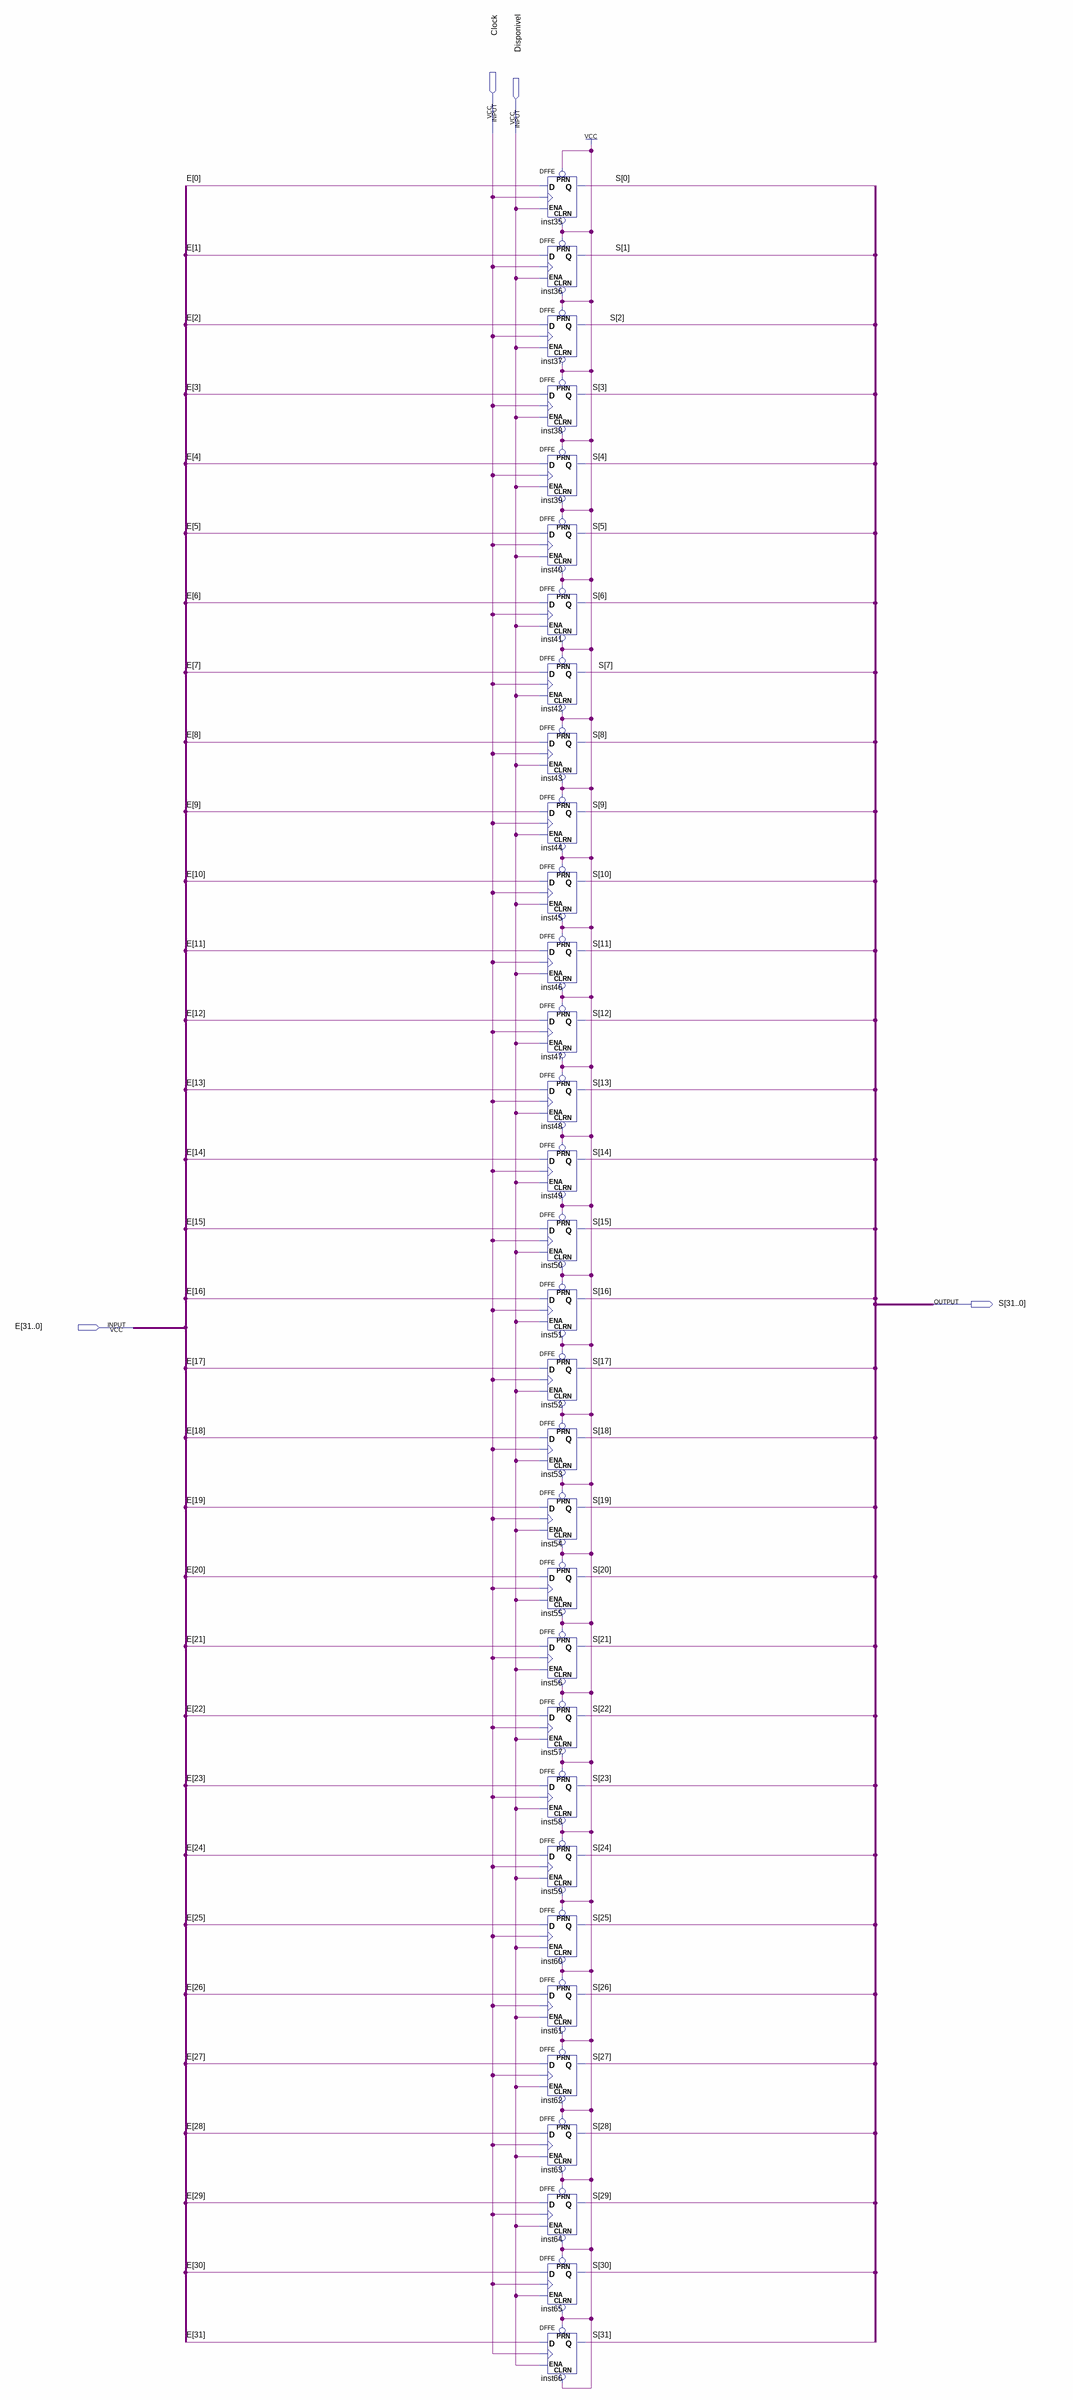
[diagram p0: schematic sheet]
// Quartus schematic Registrador.bdf as structural Verilog: 32 symbols, 4 pins
module Registrador (
  input  Clock,
  input  Disponivel,
  input  [31:0] E,
  output [31:0] S
);

  DFFE inst35 (.PRN(1'b1), .CLRN(1'b1), .D(E[0]), .CLK(Clock), .ENA(Disponivel), .Q(S[0]));
  DFFE inst36 (.PRN(1'b1), .CLRN(1'b1), .D(E[1]), .CLK(Clock), .ENA(Disponivel), .Q(S[1]));
  DFFE inst37 (.PRN(1'b1), .CLRN(1'b1), .D(E[2]), .CLK(Clock), .ENA(Disponivel), .Q(S[2]));
  DFFE inst38 (.PRN(1'b1), .CLRN(1'b1), .D(E[3]), .CLK(Clock), .ENA(Disponivel), .Q(S[3]));
  DFFE inst39 (.PRN(1'b1), .CLRN(1'b1), .D(E[4]), .CLK(Clock), .ENA(Disponivel), .Q(S[4]));
  DFFE inst40 (.PRN(1'b1), .CLRN(1'b1), .D(E[5]), .CLK(Clock), .ENA(Disponivel), .Q(S[5]));
  DFFE inst41 (.PRN(1'b1), .CLRN(1'b1), .D(E[6]), .CLK(Clock), .ENA(Disponivel), .Q(S[6]));
  DFFE inst42 (.PRN(1'b1), .CLRN(1'b1), .D(E[7]), .CLK(Clock), .ENA(Disponivel), .Q(S[7]));
  DFFE inst43 (.PRN(1'b1), .CLRN(1'b1), .D(E[8]), .CLK(Clock), .ENA(Disponivel), .Q(S[8]));
  DFFE inst44 (.PRN(1'b1), .CLRN(1'b1), .D(E[9]), .CLK(Clock), .ENA(Disponivel), .Q(S[9]));
  DFFE inst45 (.PRN(1'b1), .CLRN(1'b1), .D(E[10]), .CLK(Clock), .ENA(Disponivel), .Q(S[10]));
  DFFE inst46 (.PRN(1'b1), .CLRN(1'b1), .D(E[11]), .CLK(Clock), .ENA(Disponivel), .Q(S[11]));
  DFFE inst47 (.PRN(1'b1), .CLRN(1'b1), .D(E[12]), .CLK(Clock), .ENA(Disponivel), .Q(S[12]));
  DFFE inst48 (.PRN(1'b1), .CLRN(1'b1), .D(E[13]), .CLK(Clock), .ENA(Disponivel), .Q(S[13]));
  DFFE inst49 (.PRN(1'b1), .CLRN(1'b1), .D(E[14]), .CLK(Clock), .ENA(Disponivel), .Q(S[14]));
  DFFE inst50 (.PRN(1'b1), .CLRN(1'b1), .D(E[15]), .CLK(Clock), .ENA(Disponivel), .Q(S[15]));
  DFFE inst51 (.PRN(1'b1), .CLRN(1'b1), .D(E[16]), .CLK(Clock), .ENA(Disponivel), .Q(S[16]));
  DFFE inst52 (.PRN(1'b1), .CLRN(1'b1), .D(E[17]), .CLK(Clock), .ENA(Disponivel), .Q(S[17]));
  DFFE inst53 (.PRN(1'b1), .CLRN(1'b1), .D(E[18]), .CLK(Clock), .ENA(Disponivel), .Q(S[18]));
  DFFE inst54 (.PRN(1'b1), .CLRN(1'b1), .D(E[19]), .CLK(Clock), .ENA(Disponivel), .Q(S[19]));
  DFFE inst55 (.PRN(1'b1), .CLRN(1'b1), .D(E[20]), .CLK(Clock), .ENA(Disponivel), .Q(S[20]));
  DFFE inst56 (.PRN(1'b1), .CLRN(1'b1), .D(E[21]), .CLK(Clock), .ENA(Disponivel), .Q(S[21]));
  DFFE inst57 (.PRN(1'b1), .CLRN(1'b1), .D(E[22]), .CLK(Clock), .ENA(Disponivel), .Q(S[22]));
  DFFE inst58 (.PRN(1'b1), .CLRN(1'b1), .D(E[23]), .CLK(Clock), .ENA(Disponivel), .Q(S[23]));
  DFFE inst59 (.PRN(1'b1), .CLRN(1'b1), .D(E[24]), .CLK(Clock), .ENA(Disponivel), .Q(S[24]));
  DFFE inst60 (.PRN(1'b1), .CLRN(1'b1), .D(E[25]), .CLK(Clock), .ENA(Disponivel), .Q(S[25]));
  DFFE inst61 (.PRN(1'b1), .CLRN(1'b1), .D(E[26]), .CLK(Clock), .ENA(Disponivel), .Q(S[26]));
  DFFE inst62 (.PRN(1'b1), .CLRN(1'b1), .D(E[27]), .CLK(Clock), .ENA(Disponivel), .Q(S[27]));
  DFFE inst63 (.PRN(1'b1), .CLRN(1'b1), .D(E[28]), .CLK(Clock), .ENA(Disponivel), .Q(S[28]));
  DFFE inst64 (.PRN(1'b1), .CLRN(1'b1), .D(E[29]), .CLK(Clock), .ENA(Disponivel), .Q(S[29]));
  DFFE inst65 (.PRN(1'b1), .CLRN(1'b1), .D(E[30]), .CLK(Clock), .ENA(Disponivel), .Q(S[30]));
  DFFE inst66 (.PRN(1'b1), .CLRN(1'b1), .D(E[31]), .CLK(Clock), .ENA(Disponivel), .Q(S[31]));
endmodule
